# Altium schematic sheet [06]-DDR2_Interface.SchDoc
size A4
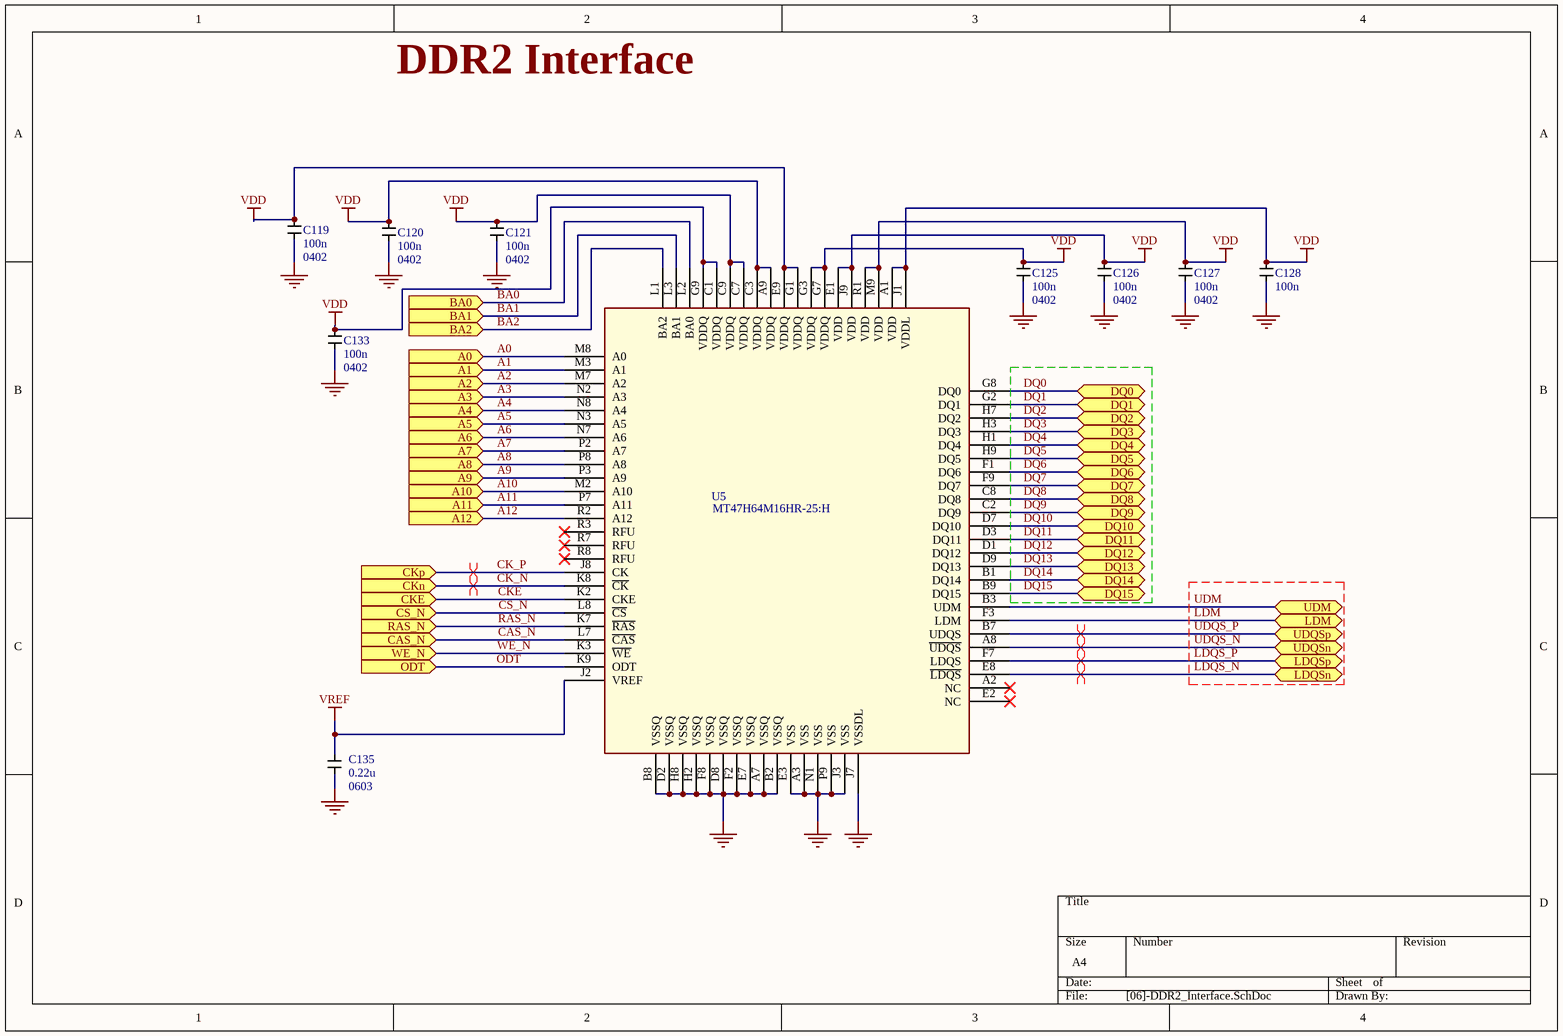
[diagram p0: [06]-DDR2_Interface.SchDoc]

## Parts
C119  100n  PCB Stake: 0402  [*CAPC1005X60N]
C120  100n  PCB Stake: 0402  [*CAPC1005X60N]
C121  100n  PCB Stake: 0402  [*CAPC1005X60N]
C125  100n  PCB Stake: 0402  [*CAPC1005X60N]
C126  100n  PCB Stake: 0402  [*CAPC1005X60N]
C127  100n  PCB Stake: 0402  [*CAPC1005X60N]
C128  100n  [*CAPC1005X60N]
C133  100n  PCB Stake: 0402  [*CAPC1005X60N]
C135  0.22u  PCB Layer:: 0603  [*0603]
U5  MT47H64M16HR-25:H  [BGA84CP80_15X9_1250X900X120B45N]

## Ports
A0 (in), A1 (in), A2 (in), A3 (in), A4 (in), A5 (in), A6 (in), A7 (in), A8 (in), A9 (in), A10 (in), A11 (in), A12 (in), BA0 (in), BA1 (in), BA2 (in), CAS_N (in), CKE (in), CKn (in), CKp (in), CS_N (in), DQ0, DQ1, DQ2, DQ3, DQ4, DQ5, DQ6, DQ7, DQ8, DQ9, DQ10, DQ11, DQ12, DQ13, DQ14, DQ15, LDM (bidir), LDQSn (bidir), LDQSp (bidir), ODT (in), RAS_N (in), UDM, UDQSn (bidir), UDQSp (bidir), WE_N (in)

## Nets
GND: C119.2 C120.2 C121.2 C125.2 C126.2 C127.2 C128.2 C133.2 C135.1 U5.A3(VSS) U5.A7(VSSQ) U5.B2(VSSQ) U5.B8(VSSQ) U5.D2(VSSQ) U5.D8(VSSQ) U5.E3(VSS) U5.E7(VSSQ) U5.F2(VSSQ) U5.F8(VSSQ) U5.H2(VSSQ) U5.H8(VSSQ) U5.J3(VSS) U5.J7(VSSDL) U5.N1(VSS) U5.P9(VSS)
VDD: C119.1 C120.1 C121.1 C125.1 C126.1 C127.1 C128.1 C133.1 U5.A1(VDD) U5.A9(VDDQ) U5.C1(VDDQ) U5.C3(VDDQ) U5.C7(VDDQ) U5.C9(VDDQ) U5.E1(VDD) U5.E9(VDDQ) U5.G1(VDDQ) U5.G3(VDDQ) U5.G7(VDDQ) U5.G9(VDDQ) U5.J1(VDDL) U5.J9(VDD) U5.M9(VDD) U5.R1(VDD)
VREF: C135.2 U5.J2(VREF)
A0: U5.M8(A0) ; port A0
A1: U5.M3(A1) ; port A1
A2: U5.M7(A2) ; port A2
A3: U5.N2(A3) ; port A3
A4: U5.N8(A4) ; port A4
A5: U5.N3(A5) ; port A5
A6: U5.N7(A6) ; port A6
A7: U5.P2(A7) ; port A7
A8: U5.P8(A8) ; port A8
A9: U5.P3(A9) ; port A9
A10: U5.M2(A10) ; port A10
A11: U5.P7(A11) ; port A11
A12: U5.R2(A12) ; port A12
BA0: U5.L2(BA0) ; port BA0
BA1: U5.L3(BA1) ; port BA1
BA2: U5.L1(BA2) ; port BA2
CAS_N: U5.L7(~{CAS}) ; port CAS_N
CK_N: U5.K8(~{CK}) ; port CKn
CK_P: U5.J8(CK) ; port CKp
CKE: U5.K2(CKE) ; port CKE
CS_N: U5.L8(~{CS}) ; port CS_N
DQ0: U5.G8(DQ0) ; port DQ0
DQ1: U5.G2(DQ1) ; port DQ1
DQ2: U5.H7(DQ2) ; port DQ2
DQ3: U5.H3(DQ3) ; port DQ3
DQ4: U5.H1(DQ4) ; port DQ4
DQ5: U5.H9(DQ5) ; port DQ5
DQ6: U5.F1(DQ6) ; port DQ6
DQ7: U5.F9(DQ7) ; port DQ7
DQ8: U5.C8(DQ8) ; port DQ8
DQ9: U5.C2(DQ9) ; port DQ9
DQ10: U5.D7(DQ10) ; port DQ10
DQ11: U5.D3(DQ11) ; port DQ11
DQ12: U5.D1(DQ12) ; port DQ12
DQ13: U5.D9(DQ13) ; port DQ13
DQ14: U5.B1(DQ14) ; port DQ14
DQ15: U5.B9(DQ15) ; port DQ15
LDM: U5.F3(LDM) ; port LDM
LDQS_N: U5.E8(~{LDQS}) ; port LDQSn
LDQS_P: U5.F7(LDQS) ; port LDQSp
ODT: U5.K9(ODT) ; port ODT
RAS_N: U5.K7(~{RAS}) ; port RAS_N
UDM: U5.B3(UDM) ; port UDM
UDQS_N: U5.A8(~{UDQS}) ; port UDQSn
UDQS_P: U5.B7(UDQS) ; port UDQSp
WE_N: U5.K3(~{WE}) ; port WE_N

Not connected (* = marked no-connect by the designer): U5 A2(NC)* E2(NC)* R3(RFU)* R7(RFU)* R8(RFU)*

## Layout directives
differential pair: CK_N, CK_P, LDQS_N, LDQS_P, UDQS_N, UDQS_P

## Notes on the sheet
- DDR2 Interface

## Library data of the parts
C119-C121 C125-C128 C133 C135 = Component_1
  C119-C121 C125-C128 C133: Buying URL:: https://uk.farnell.com/avx/04023c104kat2a/cap-0-1-f-25v-10-x7r-0402/dp/1867948RL
  C135: Buying URL:: https://uk.farnell.com/avx/0603yc105kat2a/cap-1-f-16v-10-x7r-0603/dp/1658870RL?st=1u%200603
U5 = micron_ddr2_sdram: DDR2 SDRAM with configuration of 64 Meg * 16 bits.; Designer: Faheem Minhas; Company: PhasePhotonics; 3D model: 3D contenental; PCB model: snapEDA; PCB package type: FBGA; Date Created: 18-Janruary-2019; Data Sheet URL: static6.arrow.com/aropdfconversion/e8a5cdd149c7439f33fcdfacad6c2c34fc62263c/mt47h64m16hr-25it.pdf; Byer URL: https://www.arrow.com/en/products/mt47h64m16hr-25h/micron-technology; Last Modified: 31/01/2019